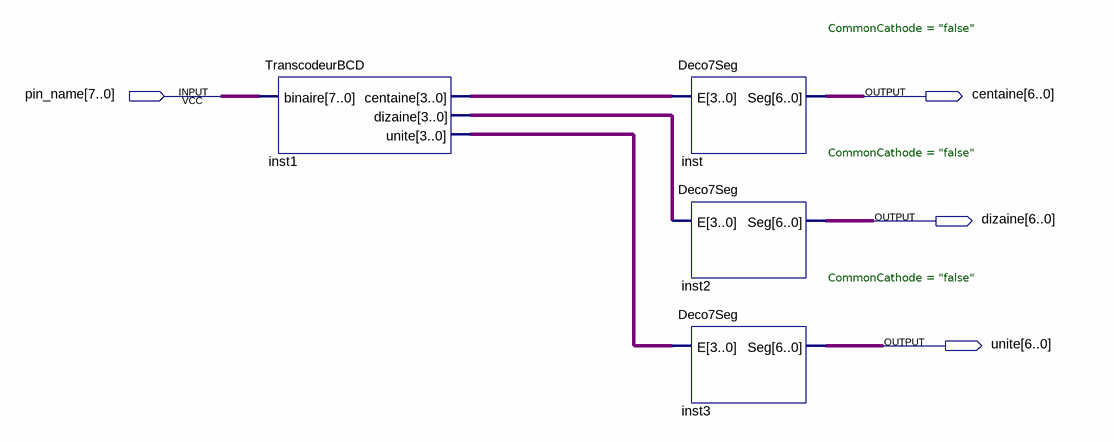
[diagram p0: schematic sheet]
// Quartus schematic afficheur.bdf as structural Verilog: 4 symbols, 4 pins
module afficheur (
  input  [7:0] pin_name,
  output [6:0] centaine,
  output [6:0] dizaine,
  output [6:0] unite
);

  wire [3:0] inst1_centaine, inst1_dizaine, inst1_unite;

  TranscodeurBCD inst1 (.binaire(pin_name), .centaine(inst1_centaine), .dizaine(inst1_dizaine), .unite(inst1_unite));
  Deco7Seg #(.CommonCathode("false")) inst (.E(inst1_centaine), .Seg(centaine));
  Deco7Seg #(.CommonCathode("false")) inst2 (.E(inst1_dizaine), .Seg(dizaine));
  Deco7Seg #(.CommonCathode("false")) inst3 (.E(inst1_unite), .Seg(unite));
endmodule
